# Altium project Balance_Car.PrjPcb
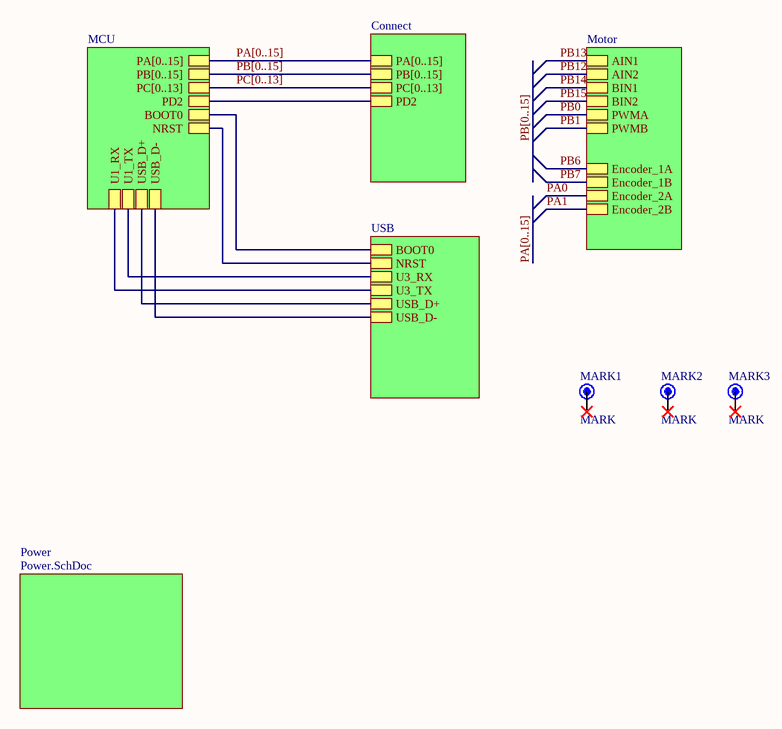
[diagram p0: Balance_CAR.SchDoc]
6 sheets, 118 parts. Net scope: hierarchical (ports join the sheet entries above them; power ports are global).
Board file: Balance_Car2.PcbDoc
Sheets:
  Balance_CAR.SchDoc
    MCU = MCU.SchDoc
    Motor = Motor_TB6612.SchDoc
    USB = CH340.SchDoc
    Connect = Connect.SchDoc
    Power = Power.SchDoc

## Sheet Balance_CAR.SchDoc
size A4

### Parts
MARK1  MARK  [MARK_GLOBAL]
MARK2  MARK  [MARK_GLOBAL]
MARK3  MARK  [MARK_GLOBAL]

### Sub-sheets
Connect = Connect.SchDoc: PA[0..15], PB[0..15], PC[0..13], PD2
MCU = MCU.SchDoc: BOOT0, NRST, PA[0..15], PB[0..15], PC[0..13], PD2, U1_RX, U1_TX, USB_D+, USB_D-
Motor = Motor_TB6612.SchDoc: AIN1, AIN2, BIN1, BIN2, PWMA, PWMB, Encoder_1A, Encoder_1B, Encoder_2A, Encoder_2B
Power = Power.SchDoc: no entries
USB = CH340.SchDoc: BOOT0, NRST, U3_RX, U3_TX, USB_D+, USB_D-

### Nets
BOOT0: sheet MCU/BOOT0, sheet USB/BOOT0
NRST: sheet MCU/NRST, sheet USB/NRST
PA9: sheet MCU/U1_TX, sheet USB/U3_RX
PA10: sheet MCU/U1_RX, sheet USB/U3_TX
PA11: sheet MCU/USB_D-, sheet USB/USB_D-
PA12: sheet MCU/USB_D+, sheet USB/USB_D+
PD2: sheet MCU/PD2, sheet Connect/PD2

Not connected (* = marked no-connect by the designer): MARK1 1*; MARK2 1*; MARK3 1*

### Buses and harness runs
bus PA[0..15]
bus PA[0..15] = sheet Connect/PA[0..15] = sheet MCU/PA[0..15]
bus PB[0..15]
bus PB[0..15] = sheet Connect/PB[0..15] = sheet MCU/PB[0..15]
bus PC[0..13] = sheet Connect/PC[0..13] = sheet MCU/PC[0..13]

### Library data of the parts
MARK1-MARK3 = MARK: 光学定位点

## Sheet MCU.SchDoc
size A4
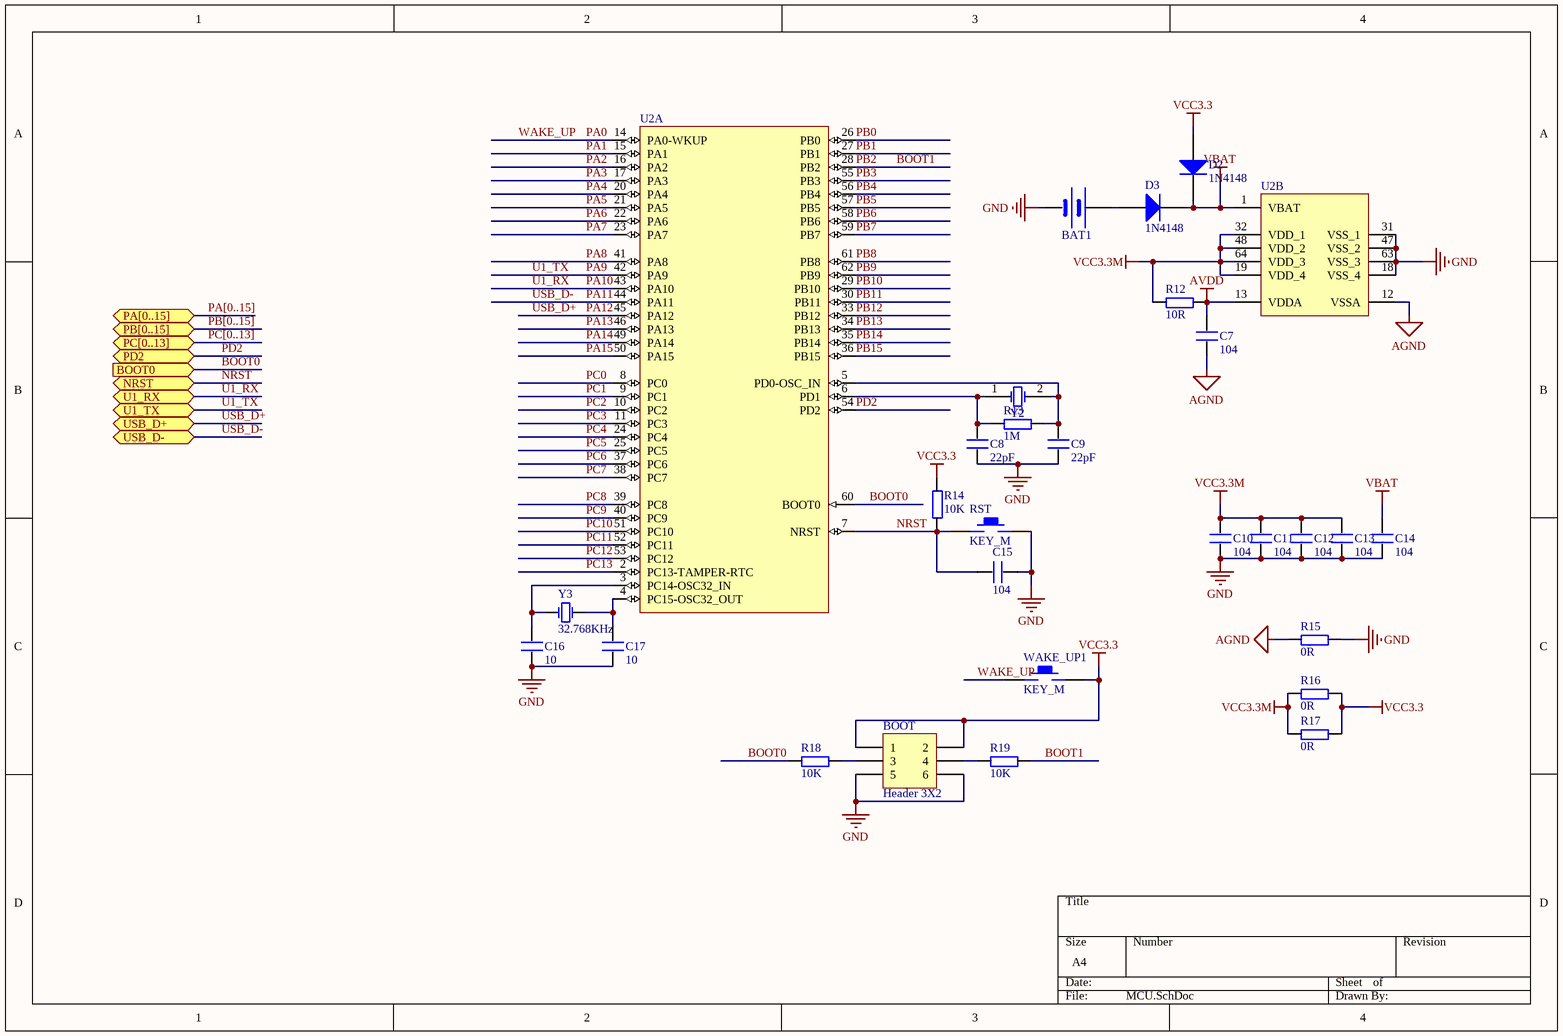
[diagram p1: MCU.SchDoc]

### Parts
BAT1  BATT  [CR1220_B]  (value not drawn)
BOOT  Header 3X2  [HDR2X3]
C7  104  [0603C]
C8  22pF  [0603C]
C9  22pF  [0603C]
C10  104  [0603C]
C11  104  [0603C]
C12  104  [0603C]
C13  104  [0603C]
C14  104  [0603C]
C15  104  [0603C]
C16  10  [0603C]
C17  10  [0603C]
D2  1N4148  [DIODE_SOP]
D3  1N4148  [DIODE_SOP]
R12  10R  [0603R]
R13  1M  [0603R]
R14  10K  [0603R]
R15  0R  [0603R]
R16  0R  [0603R]
R17  0R  [0603R]
R18  10K  [0603R]
R19  10K  [0603R]
RST  KEY_M  [KEY_SOP3625_B]
U2  (no value)  [LQFP64-10x10mm]  (parts A,B of 2)
WAKE_UP1  KEY_M  [KEY_SOP3625_B]
Y2  NX3225GD-8.000M-EXS00A-CG04874[N/A]  [XTAL_SMD]  (value not drawn)
Y3  32.768KHz  [XTAL_2SM_3R2X1R5]

### Ports
BOOT0 (in), NRST (bidir), PA[0..15], PB[0..15] (bidir), PC[0..13] (bidir), PD2 (bidir), U1_RX (bidir), U1_TX (bidir), USB_D+ (bidir), USB_D- (bidir)

### Nets
AGND: C7.1 R15.1 U2.12(VSSA)
AVDD: C7.2 R12.2 U2.13(VDDA)
GND: BAT1.2(GND) BOOT.5 BOOT.6 C8.1 C9.1 C10.1 C11.1 C12.1 C13.1 C14.1 C15.2 C16.1 C17.1 R15.2 RST.2 U2.18(VSS_4) U2.31(VSS_1) U2.47(VSS_2) U2.63(VSS_3)
VBAT: C14.2 D2.2(K) D3.2(K) U2.1(VBAT)
VCC3.3: BOOT.1 BOOT.2 D2.1(A) R14.2 R16.2 R17.2 WAKE_UP1.2
VCC3.3M: C10.2 C11.2 C12.2 C13.2 R12.1 R16.1 R17.1 U2.19(VDD_4) U2.32(VDD_1) U2.48(VDD_2) U2.64(VDD_3)
BOOT0: R18.1 U2.60(BOOT0) ; port BOOT0
BOOT1: R19.2 U2.28(PB2)  [also labelled PB2]
NRST: C15.1 R14.1 RST.1 U2.7(NRST) ; port NRST
PA0: U2.14(PA0-WKUP) WAKE_UP1.1  [also labelled WAKE_UP]  [project net Encoder_2A]
PA1: U2.15(PA1)  [project net Encoder_2B]
PA2: U2.16(PA2)
PA3: U2.17(PA3)
PA4: U2.20(PA4)
PA5: U2.21(PA5)
PA6: U2.22(PA6)
PA7: U2.23(PA7)
PA8: U2.41(PA8)
PA9: U2.42(PA9) ; port U1_TX  [also labelled U1_TX]
PA10: U2.43(PA10) ; port U1_RX  [also labelled U1_RX]
PA11: U2.44(PA11) ; port USB_D-  [also labelled USB_D-]
PA12: U2.45(PA12) ; port USB_D+  [also labelled USB_D+]
PA13: U2.46(PA13)
PA14: U2.49(PA14)
PA15: U2.50(PA15)
PB0: U2.26(PB0)
PB1: U2.27(PB1)
PB3: U2.55(PB3)
PB4: U2.56(PB4)
PB5: U2.57(PB5)
PB6: U2.58(PB6)  [project net Encoder_1A]
PB7: U2.59(PB7)  [project net Encoder_1B]
PB8: U2.61(PB8)
PB9: U2.62(PB9)
PB10: U2.29(PB10)
PB11: U2.30(PB11)
PB12: U2.33(PB12)
PB13: U2.34(PB13)
PB14: U2.35(PB14)
PB15: U2.36(PB15)
PC0: U2.8(PC0)
PC1: U2.9(PC1)
PC2: U2.10(PC2)
PC3: U2.11(PC3)
PC4: U2.24(PC4)
PC5: U2.25(PC5)
PC6: U2.37(PC6)
PC7: U2.38(PC7)
PC8: U2.39(PC8)
PC9: U2.40(PC9)
PC10: U2.51(PC10)
PC11: U2.52(PC11)
PC12: U2.53(PC12)
PC13: U2.2(PC13-TAMPER-RTC)
PD2: U2.54(PD2) ; port PD2
NetBAT1_1: BAT1.1(VCC) D3.1(A)
NetBOOT_3: BOOT.3 R18.2
NetBOOT_4: BOOT.4 R19.1
NetC8_2: C8.2 R13.1 U2.6(PD1) Y2.1(OSC1)
NetC9_2: C9.2 R13.2 U2.5(PD0-OSC_IN) Y2.2(OSC2)
NetC16_2: C16.2 U2.3(PC14-OSC32_IN) Y3.1(OSC1)
NetC17_2: C17.2 U2.4(PC15-OSC32_OUT) Y3.2(OSC2)

### Buses and harness runs
bus PA[0..15] = port PA[0..15]
bus PB[0..15] = port PB[0..15]
bus PC[0..13] = port PC[0..13]

### Library data of the parts
BAT1 = BAT
BOOT = Header 3X2: Header, 3-Pin, Dual row; LatestRevisionDate: 17-Jul-2002; LatestRevisionNote: Re-released for DXP Platform.; Publisher: Altium Limited
C7-C17 = C
D2 D3 = Diode: Default Diode; Code - JEDEC: DO-214-AB; Ordered by: STM; ECCN_US/EU: EAR99/NEC; Published: 8-Jun-2000; Revision: July-2002: Re-released for DXP Platform.; Publisher: Altium Limited
R12-R19 = R
U2 = STM32F103RCT6: STM32 ARM-based 32-bit MCU Performance Line with 256 kB Flash, 48 kB Internal RAM, -40 to +85癈 Temperature, 64-Pin LQFP, Tray; DatasheetVersion: rev8.0, Apr-2011; PackageVersion: rev13, Apr-2011; PackageReference: LQFP64; PackageDescription: 64-Pin Low-Profile Quad Flat Pack, 10 x 10 mm Body, 0.5 mm Pitch (LQFP64); ComponentLink1Description: Manufacturer URL; ComponentLink1URL: http://www.st.com/; ComponentLink2Description: STM32F103 Datasheet; ComponentLink2URL: http://www.st.com/internet/com/TECHNICAL_RESOURCES/TECHNICAL_LITERATURE/DATASHEET/CD00191185.pdf; ComponentLink3Description: STM32 Family Web Page; ComponentLink3URL: www.st.com/stm32
Y2 = XTAL: Crystal Oscillator; Published: 8-Jun-2000; LatestRevisionDate: 17-Jul-2002; LatestRevisionNote: Re-released for DXP Platform.; PackageReference: R38; Publisher: Altium Limited
Y3 = XTAL: 普通晶振; Published: 8-Jun-2000; LatestRevisionDate: 17-Jul-2002; LatestRevisionNote: Re-released for DXP Platform.; Publisher: Altium Limited

## Sheet Motor_TB6612.SchDoc
size A4
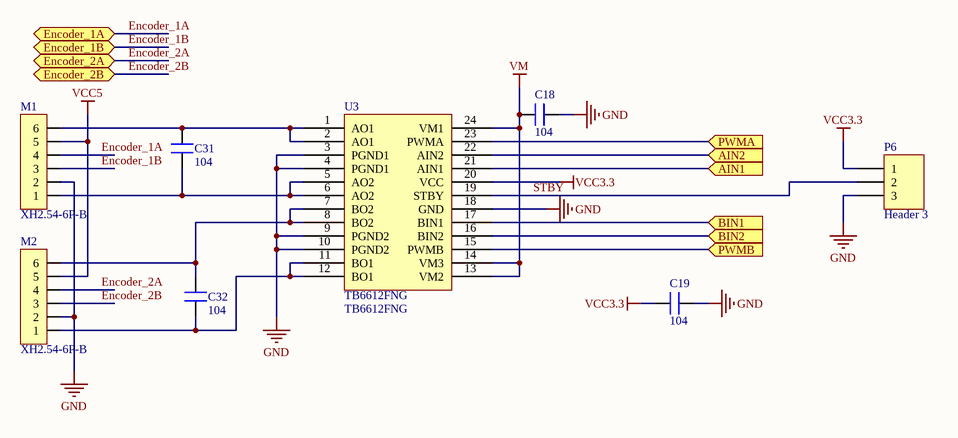
[diagram p2: Motor_TB6612.SchDoc]

### Parts
C18  104  [0603C]
C19  104  [0603C]
C31  104  [0603C]
C32  104  [0603C]
M1  XH2.54-6P-B  [XH2.54-6P-A]
M2  XH2.54-6P-B  [XH2.54-6P-A]
P6  Header 3  [HDR1X3]
U3  TB6612FNG  [SSOP24-300-0.65D]

### Ports
AIN1 (in), AIN2 (in), BIN1 (in), BIN2 (in), Encoder_1A, Encoder_1B, Encoder_2A, Encoder_2B, PWMA (in), PWMB (in)

### Nets
GND: C18.2 C19.2 M1.2 M2.2 P6.3 U3.3(PGND1) U3.4(PGND1) U3.9(PGND2) U3.10(PGND2) U3.18(GND)
VCC3.3: C19.1 P6.1 U3.20(VCC)
VCC5: M1.5 M2.5
VM: C18.1 U3.13(VM2) U3.14(VM3) U3.24(VM1)
Encoder_1A: M1.4 ; port Encoder_1A
Encoder_1B: M1.3 ; port Encoder_1B
Encoder_2A: M2.4 ; port Encoder_2A
Encoder_2B: M2.3 ; port Encoder_2B
PB0: U3.23(PWMA) ; port PWMA
PB1: U3.15(PWMB) ; port PWMB
PB12: U3.22(AIN2) ; port AIN2
PB13: U3.21(AIN1) ; port AIN1
PB14: U3.17(BIN1) ; port BIN1
PB15: U3.16(BIN2) ; port BIN2
STBY: P6.2 U3.19(STBY)
NetC31_1: C31.1 M1.1 U3.5(AO2) U3.6(AO2)
NetC31_2: C31.2 M1.6 U3.1(AO1) U3.2(AO1)
NetC32_1: C32.1 M2.1 U3.11(BO1) U3.12(BO1)
NetC32_2: C32.2 M2.6 U3.7(BO2) U3.8(BO2)

### Library data of the parts
C18 C19 C31 C32 = C
P6 = Header 3: Header, 3-Pin; LatestRevisionDate: 17-Jul-2002; LatestRevisionNote: Re-released for DXP Platform.; Publisher: Altium Limited

## Sheet CH340.SchDoc
size A4
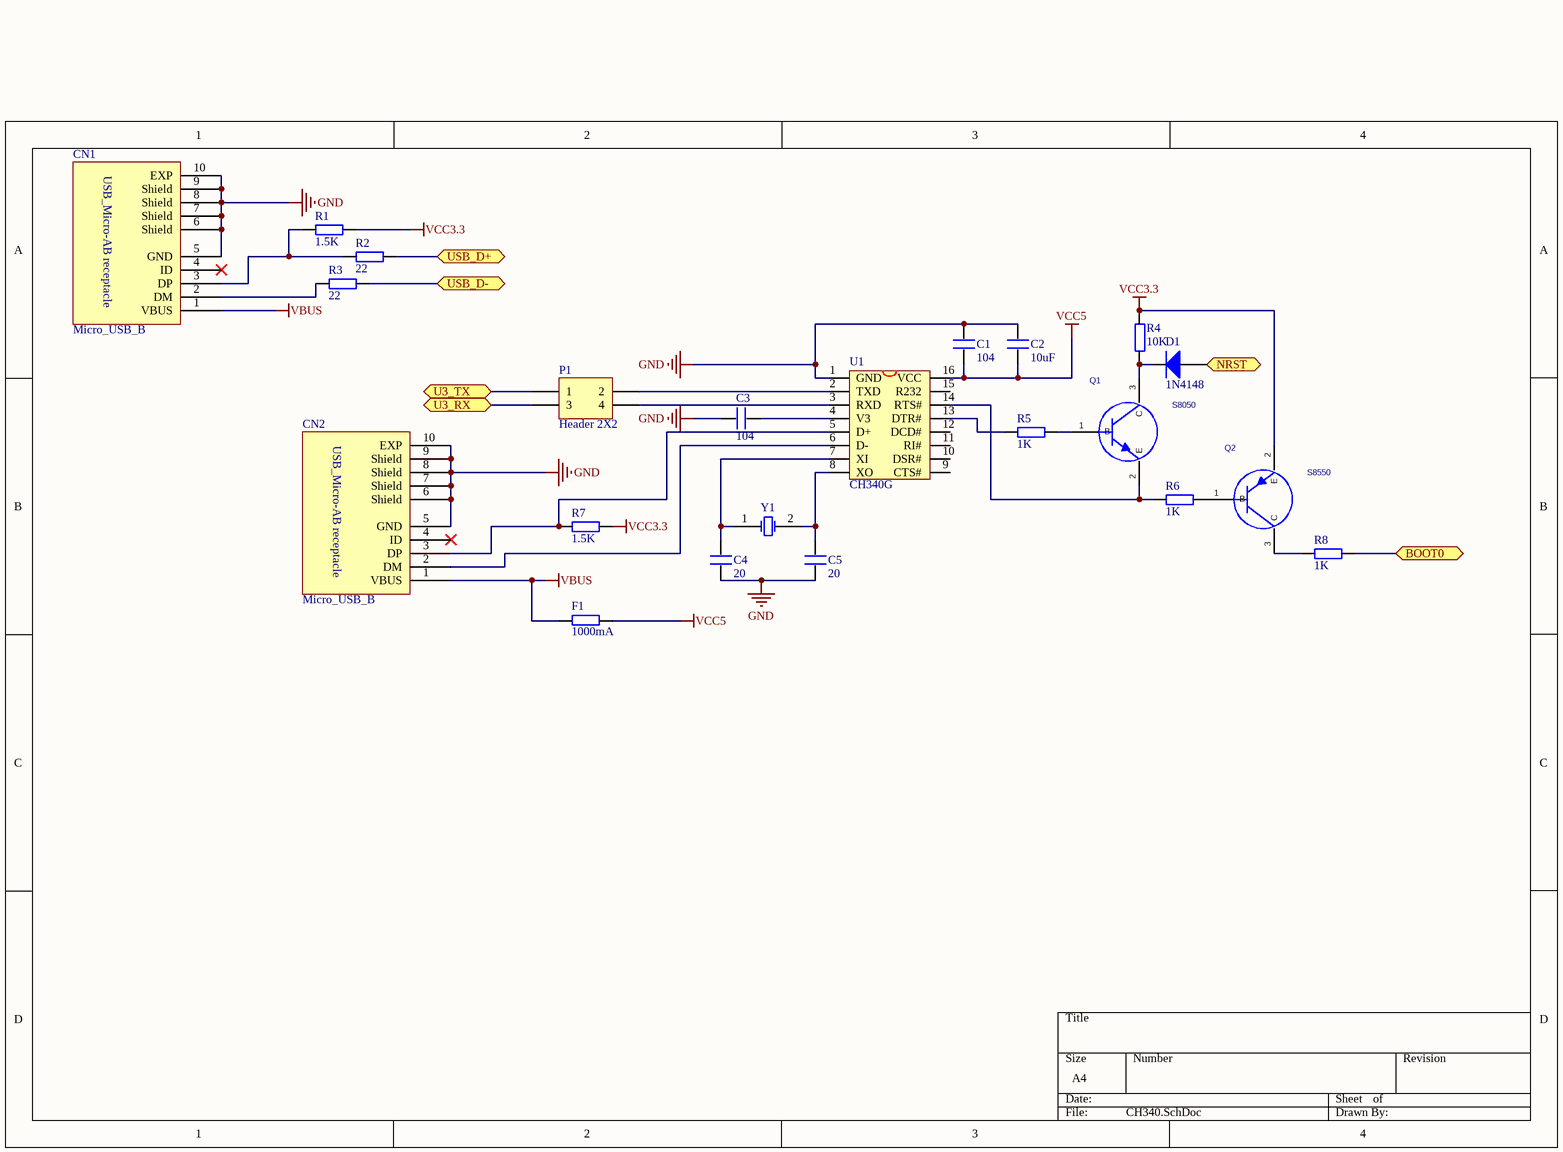
[diagram p3: CH340.SchDoc]

### Parts
C1  104  [0603C]
C2  10uF  [0805C]
C3  104  [0603C]
C4  20  [0603C]
C5  20  [0603C]
CN1  Micro_USB_B  [Molex_1050170001]
CN2  Micro_USB_B  [Molex_1050170001]
D1  1N4148  [DIODE_SOP]
F1  1000mA  [0805F]
P1  Header 2X2  [HDR2X2]
Q1  S8050  [SOT-23]
Q2  S8550  [SOT-23]
R1  1.5K  [0603R]
R2  22  [0603R]
R3  22  [0603R]
R4  10K  [0603R]
R5  1K  [0603R]
R6  1K  [0603R]
R7  1.5K  [0603R]
R8  1K  [0603R]
U1  CH340G  [SOP16_M]
Y1  NX3225GD-8.000M-EXS00A-CG04874[N/A]  [XTAL_SMD]  (value not drawn)

### Ports
BOOT0 (bidir), NRST (bidir), U3_RX (bidir), U3_TX (bidir), USB_D+ (bidir), USB_D- (bidir)

### Nets
GND: C1.2 C2.2 C3.2 C4.1 C5.1 CN1.5(GND) CN1.6(Shield) CN1.7(Shield) CN1.8(Shield) CN1.9(Shield) CN1.10(EXP) CN2.5(GND) CN2.6(Shield) CN2.7(Shield) CN2.8(Shield) CN2.9(Shield) CN2.10(EXP) U1.1(GND)
VBUS: CN1.1(VBUS) CN2.1(VBUS) F1.2
VCC3.3: Q2.2(E) R1.2 R4.2 R7.2
VCC5: C1.1 C2.1 F1.1 U1.16(VCC)
BOOT0: R8.2 ; port BOOT0
NRST: D1.1(A) ; port NRST
PA9: P1.3 ; port U3_RX
PA10: P1.1 ; port U3_TX
PA11: R3.2 ; port USB_D-
PA12: R2.2 ; port USB_D+
NetC3_1: C3.1 U1.4(V3)
NetC4_2: C4.2 U1.7(XI) Y1.1(OSC1)
NetC5_2: C5.2 U1.8(XO) Y1.2(OSC2)
NetCN1_2: CN1.2(DM) R3.1
NetCN1_3: CN1.3(DP) R1.1 R2.1
NetCN2_2: CN2.2(DM) U1.6(D-)
NetCN2_3: CN2.3(DP) R7.1 U1.5(D+)
NetD1_2: D1.2(K) Q1.3(C) R4.1
NetP1_2: P1.2 U1.2(TXD)
NetP1_4: P1.4 U1.3(RXD)
NetQ1_1: Q1.1(B) R5.2
NetQ1_2: Q1.2(E) R6.1 U1.14(RTS#)
NetQ2_1: Q2.1(B) R6.2
NetQ2_3: Q2.3(C) R8.1
NetR5_1: R5.1 U1.13(DTR#)

Not connected (* = marked no-connect by the designer): CN1 4(ID)*; CN2 4(ID)*; U1 9(CTS#) 10(DSR#) 11(RI#) 12(DCD#) 15(R232)

### Notes on the sheet
- (in symbol Micro_USB_B) USB_Micro-AB receptacle

### Library data of the parts
C1-C5 = C
D1 = Diode: as D2 on sheet MCU; Published: 8-Jun-2000; Revision: July-2002: Re-released for DXP Platform.; Publisher: Altium Limited
F1 R1-R8 = R
P1 = Header 2X2: Header, 2-Pin, Dual row; LatestRevisionDate: 17-Jul-2002; LatestRevisionNote: Re-released for DXP Platform.; Publisher: Altium Limited
Q1 = S8050: NPN; Manufacturer #2: 8050; PCB DECAL: SOT-23
Q2 = S8550: NPN; Manufacturer #2: 8050; PCB DECAL: SOT-23
U1 = CH340G: USB2UART
Y1 = XTAL: Crystal Oscillator; Published: 8-Jun-2000; LatestRevisionDate: 17-Jul-2002; LatestRevisionNote: Re-released for DXP Platform.; PackageReference: R38; Publisher: Altium Limited

## Sheet Connect.SchDoc: Balance_Car 主控板外设部分
size A4; Date: 2017/3/23; Author: 卢晗; DrawnBy: 卢晗; Engineer: 卢晗; Revision: V1.0
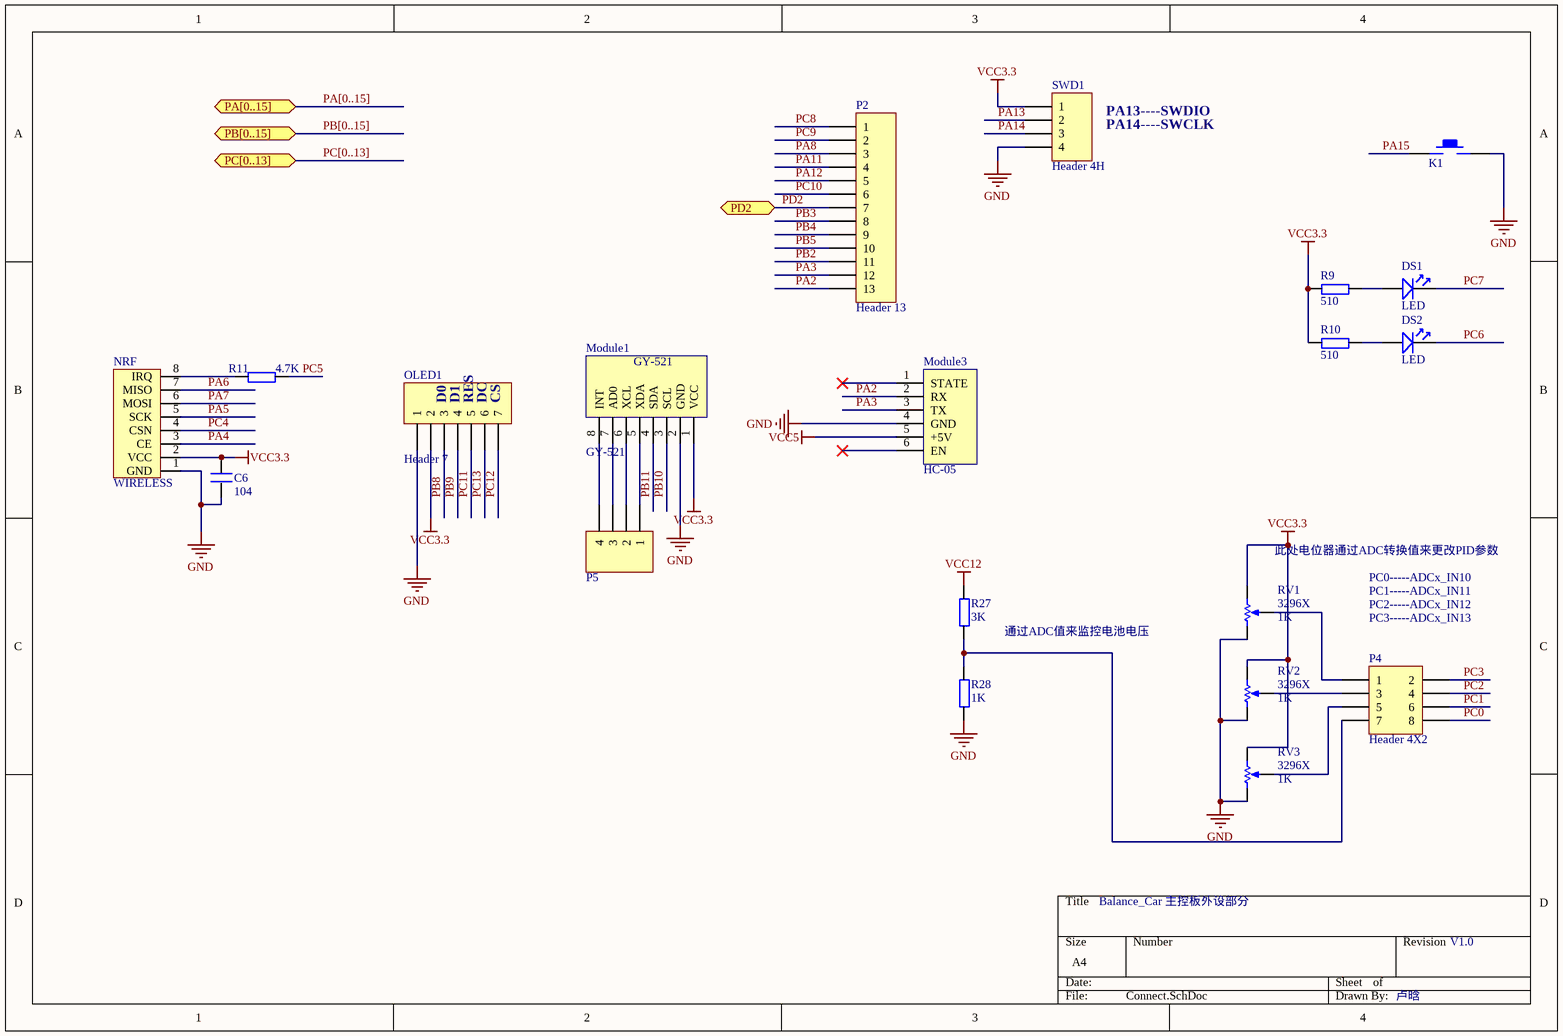
[diagram p4: Connect.SchDoc]

### Parts
C6  104  [0603C]
DS1  LED  [0603D-R]
DS2  LED  [0603D-R]
K1  KEY_M  [KEY_SOP3625_B]  (value not drawn)
Module1  GY-521  [GY-521]
Module3  HC-05  [HC-05]
NRF  WIRELESS  [NRF24L01]
OLED1  Header 7  [HDR1X7]
P2  Header 13  [HDR1X13]
P4  Header 4X2  [HDR2X4]
P5  Header 4  [HDR_1x4_2R54_V_M]  (value not drawn)
R9  510  [0603R]
R10  510  [0603R]
R11  4.7K  [0603R]
R27  3K  [0603R]
R28  1K  [0603R]
RV1  3296X  value 1K  [VR5-R]
RV2  3296X  value 1K  [VR5-R]
RV3  3296X  value 1K  [VR5-R]
SWD1  Header 4H  [HDR1X4H]

### Ports
PA[0..15] (bidir), PB[0..15] (bidir), PC[0..13] (bidir), PD2 (bidir)

### Nets
GND: C6.1 K1.2 Module1.2(GND) Module3.4(GND) NRF.1(GND) OLED1.1 R28.1 RV1.1(TOP) RV2.1(TOP) RV3.1(TOP) SWD1.4
VCC3.3: C6.2 Module1.1(VCC) NRF.2(VCC) OLED1.2 R9.1 R10.1 RV1.3(TAP) RV2.3(TAP) RV3.3(TAP) SWD1.1
VCC5: Module3.5(+5V)
VCC12: R27.2
PA2: Module3.2(RX) P2.13
PA3: Module3.3(TX) P2.12
PA4: NRF.3(CE)
PA5: NRF.5(SCK)
PA6: NRF.7(MISO)
PA7: NRF.6(MOSI)
PA8: P2.3
PA11: P2.4
PA12: P2.5
PA13: SWD1.2
PA14: SWD1.3
PA15: K1.1
PB2: P2.11  [project net BOOT1]
PB3: P2.8
PB4: P2.9
PB5: P2.10
PB8: OLED1.3
PB9: OLED1.4
PB10: Module1.3(SCL)
PB11: Module1.4(SDA)
PC0: P4.8
PC1: P4.6
PC2: P4.4
PC3: P4.2
PC4: NRF.4(CSN)
PC5: R11.2
PC6: DS2.2
PC7: DS1.2
PC8: P2.1
PC9: P2.2
PC10: P2.6
PC11: OLED1.5
PC12: OLED1.7
PC13: OLED1.6
PD2: P2.7 ; port PD2
NetDS1_1: DS1.1 R9.2
NetDS2_1: DS2.1 R10.2
NetModule1_5: Module1.5(XDA) P5.1
NetModule1_6: Module1.6(XCL) P5.2
NetModule1_7: Module1.7(AD0) P5.3
NetModule1_8: Module1.8(INT) P5.4
NetNRF_8: NRF.8(IRQ) R11.1
NetP4_1: P4.1 RV1.2(BOT)
NetP4_3: P4.3 RV2.2(BOT)
NetP4_5: P4.5 RV3.2(BOT)
NetP4_7: P4.7 R27.1 R28.2

Not connected (* = marked no-connect by the designer): Module3 1(STATE)* 6(EN)*

### Buses and harness runs
bus PA[0..15] = port PA[0..15]
bus PB[0..15] = port PB[0..15]
bus PC[0..13] = port PC[0..13]

### Notes on the sheet
- PA13----SWDIO
- PA14----SWCLK
- (near OLED1) D0
- (near OLED1) D1
- (near OLED1) RES
- (near OLED1) DC
- (near OLED1) CS
- (near RV1) 此处电位器通过ADC转换值来更改PID参数
- PC0-----ADCx_IN10
- 通过ADC值来监控电池电压
- PC1-----ADCx_IN11
- PC2-----ADCx_IN12
- PC3-----ADCx_IN13

### Library data of the parts
C6 = C
Module3 = HC-05: Bluetooth Module(HC-05)
NRF = NRF24L01
OLED1 = Header 7: Header, 7-Pin; LatestRevisionDate: 17-Jul-2002; LatestRevisionNote: Re-released for DXP Platform.; Publisher: Altium Limited
P2 = Header 13: Header, 13-Pin; LatestRevisionDate: 17-Jul-2002; LatestRevisionNote: Re-released for DXP Platform.; Publisher: Altium Limited
P4 = Header 4X2: Header, 4-Pin, Dual row; LatestRevisionDate: 17-Jul-2002; LatestRevisionNote: Re-released for DXP Platform.; Publisher: Altium Limited
P5 = Header 4: Header, 4-Pin, Single row; Revision: 17-Jul-2002: Re-released for DXP Platform.; Publisher: Altium Limited
R9-R11 R27 R28 = R
RV1-RV3 = RPot: Potentiometer; Sim Note: Enter the Resistance value and the set point into parameter fields.; Set Position: 0.5; Published: 8-Jun-2000; LatestRevisionDate: 17-Jul-2002; LatestRevisionNote: Re-released for DXP Platform.; PackageReference: VR5; Publisher: Altium Limited; PackageDescription: Variable Resistor, Thru-Hole; 3 Leads
SWD1 = Header 4H: Header, 4-Pin, Right Angle; LatestRevisionDate: 17-Jul-2002; LatestRevisionNote: Re-released for DXP Platform.; Publisher: Altium Limited

## Sheet Power.SchDoc: Balance_Car主控板电源
size A4; Date: 2017/3/23; DrawnBy: 卢晗; Engineer: 卢晗; DocumentNumber: 2; Revision: 1.0; ProjectName: Balance_Ccar
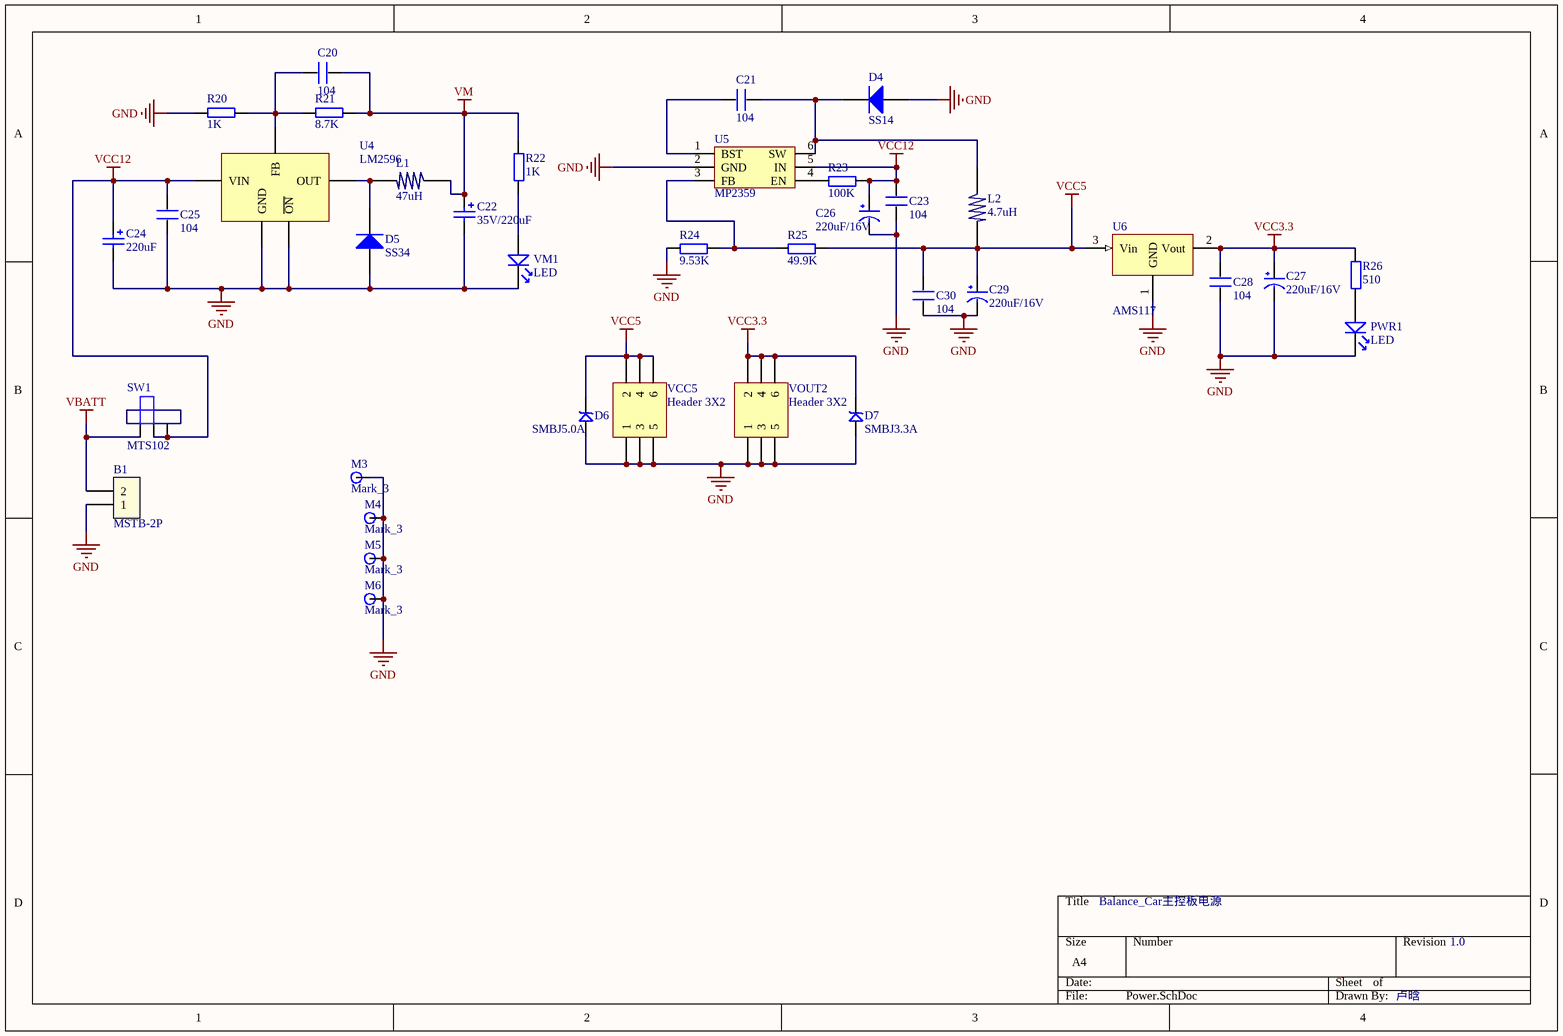
[diagram p5: Power.SchDoc]

### Parts
B1  MSTB-2P  [MSTB-2P]
C20  104  [0603C]
C21  104  [0603C]
C22  35V/220uF  [C_AUL-9.0*8.2]
C23  104  [0603C]
C24  220uF  [C_AUL-9.0*8.2]
C25  104  [0603C]
C26  220uF/16V  [C_AUL-6.6*7]
C27  220uF/16V  [C_AUL-6.6*7]
C28  104  [0603C]
C29  220uF/16V  [C_AUL-6.6*7]
C30  104  [0603C]
D4  SS14  [SMA/DO-214AC]
D5  SS34  [SMB/DO-214AA]
D6  SMBJ5.0A  [SMB/DO-214AA]
D7  SMBJ3.3A  [SMB/DO-214AA]
L1  47uH  [CDRH127]
L2  4.7uH  [CDRH74]
M3  Mark_3  [Mark3]
M4  Mark_3  [Mark3]
M5  Mark_3  [Mark3]
M6  Mark_3  [Mark3]
PWR1  LED  [0603D-R]
R20  1K  [0603R]
R21  8.7K  [0603R]
R22  1K  [0603R]
R23  100K  [0603R]
R24  9.53K  [0603R]
R25  49.9K  [0603R]
R26  510  [0603R]
SW1  MTS102  [MTS102]
U4  LM2596  [TO-263-5]
U5  MP2359  [SOT23-6L(PITCH 0.95)]
U6  AMS117  [SOT-223]
VCC5  Header 3X2  [HDR2X3]
VM1  LED  [0603D-R]
VOUT2  Header 3X2  [HDR2X3]

### Nets
GND: B1.1 C22.2 C23.1 C24.2 C25.1 C26.2(GND) C27.2(GND) C28.1 C29.2(GND) C30.1 D4.1(A) D5.1(A) D6.1 D7.1 M3.1 M4.1 M5.1 M6.1 PWR1.2 R20.2 R24.1 U4.3(GND) U4.5(~{ON}) U5.2(GND) U6.1(GND) VCC5.1 VCC5.3 VCC5.5 VM1.2 VOUT2.1 VOUT2.3 VOUT2.5
VBATT: B1.2 SW1.1
VCC3.3: C27.1(VCC) C28.2 D7.2 R26.2 U6.2(Vout) VOUT2.2 VOUT2.4 VOUT2.6
VCC5: C29.1(VCC) C30.2 D6.2 L2.1 R25.2 U6.3(Vin) VCC5.2 VCC5.4 VCC5.6
VCC12: C23.2 C24.1 C25.2 C26.1(VCC) R23.2 SW1.2 SW1.3 U4.1(VIN) U5.5(IN)
VM: C20.1 C22.1 L1.2 R21.1 R22.2
NetC20_2: C20.2 R20.1 R21.2 U4.4(FB)
NetC21_1: C21.1 U5.1(BST)
NetC21_2: C21.2 D4.2(K) L2.2 U5.6(SW)
NetD5_2: D5.2(K) L1.1 U4.2(OUT)
NetPWR1_1: PWR1.1 R26.1
NetR22_1: R22.1 VM1.1
NetR23_1: R23.1 U5.4(EN)
NetR24_2: R24.2 R25.1 U5.3(FB)

### Library data of the parts
C20 C21 C23 C25 C30 = C
C22 C24 = Cap_Alumi: Aluminum cap; Manuf_1: VISHAY; Manuf_Part_1: 293D106X9010A2TE3; Value: 10uF; Revision: July-2002: Re-released for DXP Platform.; Order: *; ECCN_US/EU: n/a
C26 C27 C29 = CAP
C28 = C21
D4 D5 = Diode: as D2 on sheet MCU; Published: 8-Jun-2000; Revision: July-2002: Re-released for DXP Platform.; Publisher: Altium Limited
D6 D7 = SMBJ: TVS
L1 L2 = L
M3-M6 = Mark_3: 3mm安装孔
R20-R26 = R
U5 = MP2359: DC DC Step Down IC
U6 = AMS1117
VCC5 VOUT2 = Header 3X2: Header, 3-Pin, Dual row; LatestRevisionDate: 17-Jul-2002; LatestRevisionNote: Re-released for DXP Platform.; Publisher: Altium Limited

## Nets that join several sheets
GND: MCU (19 pins), Motor_TB6612 (10 pins), CH340 (18 pins), Connect (11 pins), Power (32 pins)
VCC3.3: MCU (7 pins), Motor_TB6612 (C19.1 P6.1 U3.20), CH340 (Q2.2 R1.2 R4.2 R7.2), Connect (10 pins), Power (8 pins)
VCC5: Motor_TB6612 (M1.5 M2.5), CH340 (C1.1 C2.1 F1.1 U1.16), Connect (Module3.5), Power (9 pins)
VCC12: Connect (R27.2), Power (9 pins)
VM: Motor_TB6612 (C18.1 U3.13 U3.14 U3.24), Power (5 pins)
BOOT0: MCU (R18.1 U2.60), CH340 (R8.2)
BOOT1: MCU (R19.2 U2.28), Connect (P2.11)
Encoder_1A: MCU (U2.58), Motor_TB6612 (M1.4)
Encoder_1B: MCU (U2.59), Motor_TB6612 (M1.3)
Encoder_2A: MCU (U2.14 WAKE_UP1.1), Motor_TB6612 (M2.4)
Encoder_2B: MCU (U2.15), Motor_TB6612 (M2.3)
NRST: MCU (C15.1 R14.1 RST.1 U2.7), CH340 (D1.1)
PA2: MCU (U2.16), Connect (Module3.2 P2.13)
PA3: MCU (U2.17), Connect (Module3.3 P2.12)
PA4: MCU (U2.20), Connect (NRF.3)
PA5: MCU (U2.21), Connect (NRF.5)
PA6: MCU (U2.22), Connect (NRF.7)
PA7: MCU (U2.23), Connect (NRF.6)
PA8: MCU (U2.41), Connect (P2.3)
PA9: MCU (U2.42), CH340 (P1.3)
PA10: MCU (U2.43), CH340 (P1.1)
PA11: MCU (U2.44), CH340 (R3.2), Connect (P2.4)
PA12: MCU (U2.45), CH340 (R2.2), Connect (P2.5)
PA13: MCU (U2.46), Connect (SWD1.2)
PA14: MCU (U2.49), Connect (SWD1.3)
PA15: MCU (U2.50), Connect (K1.1)
PB0: MCU (U2.26), Motor_TB6612 (U3.23)
PB1: MCU (U2.27), Motor_TB6612 (U3.15)
PB3: MCU (U2.55), Connect (P2.8)
PB4: MCU (U2.56), Connect (P2.9)
PB5: MCU (U2.57), Connect (P2.10)
PB8: MCU (U2.61), Connect (OLED1.3)
PB9: MCU (U2.62), Connect (OLED1.4)
PB10: MCU (U2.29), Connect (Module1.3)
PB11: MCU (U2.30), Connect (Module1.4)
PB12: MCU (U2.33), Motor_TB6612 (U3.22)
PB13: MCU (U2.34), Motor_TB6612 (U3.21)
PB14: MCU (U2.35), Motor_TB6612 (U3.17)
PB15: MCU (U2.36), Motor_TB6612 (U3.16)
PC0: MCU (U2.8), Connect (P4.8)
PC1: MCU (U2.9), Connect (P4.6)
PC2: MCU (U2.10), Connect (P4.4)
PC3: MCU (U2.11), Connect (P4.2)
PC4: MCU (U2.24), Connect (NRF.4)
PC5: MCU (U2.25), Connect (R11.2)
PC6: MCU (U2.37), Connect (DS2.2)
PC7: MCU (U2.38), Connect (DS1.2)
PC8: MCU (U2.39), Connect (P2.1)
PC9: MCU (U2.40), Connect (P2.2)
PC10: MCU (U2.51), Connect (P2.6)
PC11: MCU (U2.52), Connect (OLED1.5)
PC12: MCU (U2.53), Connect (OLED1.7)
PC13: MCU (U2.2), Connect (OLED1.6)
PD2: MCU (U2.54), Connect (P2.7)